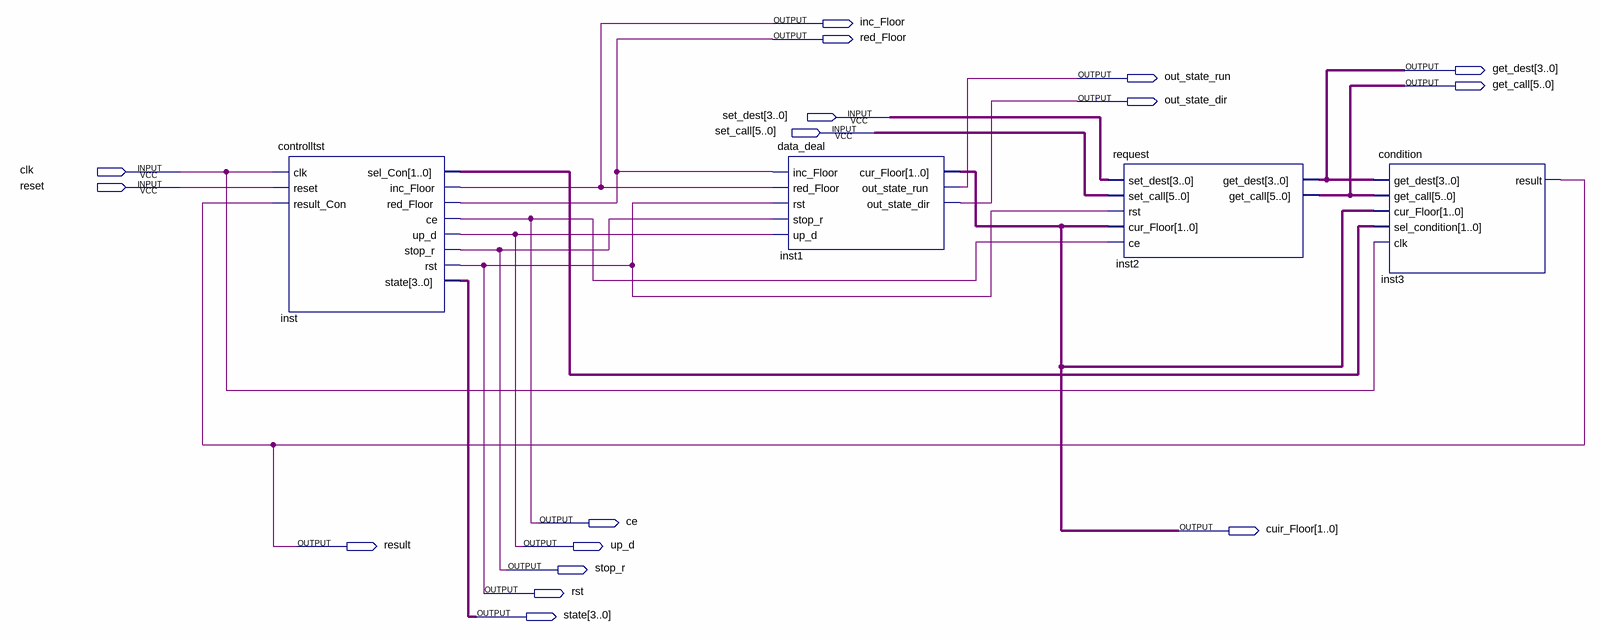
[diagram p0: schematic sheet]
// Quartus schematic t2.bdf as structural Verilog: 4 symbols, 17 pins
module t2 (
  input  [3:0] set_dest,
  input  [5:0] set_call,
  input  clk,
  input  reset,
  output inc_Floor,
  output red_Floor,
  output [3:0] get_dest,
  output out_state_run,
  output [5:0] get_call,
  output out_state_dir,
  output ce,
  output [1:0] cuir_Floor,
  output result,
  output up_d,
  output stop_r,
  output rst,
  output [3:0] state
);

  wire [1:0] inst_sel_con;

  controlltst inst (
    .clk(clk), .reset(reset), .result_Con(result), .sel_Con(inst_sel_con), .inc_Floor(inc_Floor),
    .red_Floor(red_Floor), .ce(ce), .up_d(up_d), .stop_r(stop_r), .rst(rst), .state(state));
  data_deal inst1 (
    .inc_Floor(red_Floor), .red_Floor(inc_Floor), .rst(rst), .stop_r(stop_r), .up_d(up_d),
    .cur_Floor(cuir_Floor), .out_state_run(out_state_run), .out_state_dir(out_state_dir));
  request inst2 (
    .set_dest(set_dest), .set_call(set_call), .rst(rst), .cur_Floor(cuir_Floor), .ce(ce),
    .get_dest(get_dest), .get_call(get_call));
  condition inst3 (
    .get_dest(get_dest), .get_call(get_call), .cur_Floor(cuir_Floor), .sel_condition(inst_sel_con),
    .clk(clk), .result(result));
endmodule
